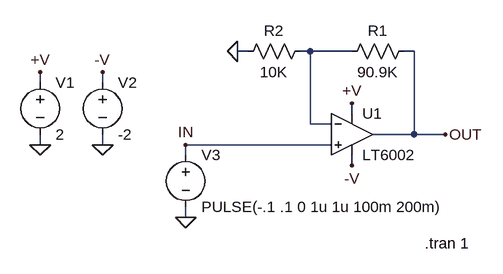
[diagram p0: schematic 6002.asc]
6002.asc, the LTspice schematic file:
Version 4
SHEET 1 880 756
WIRE 32 400 16 400
WIRE 128 400 112 400
WIRE 192 400 128 400
WIRE 288 400 272 400
WIRE -288 448 -288 432
WIRE -192 448 -192 432
WIRE 192 496 192 480
WIRE 128 512 128 400
WIRE 160 512 128 512
WIRE 288 528 288 400
WIRE 288 528 224 528
WIRE 336 528 288 528
WIRE -288 544 -288 528
WIRE -192 544 -192 528
WIRE 160 544 -64 544
WIRE -64 560 -64 544
WIRE 192 576 192 560
WIRE -64 656 -64 640
FLAG -288 544 0
FLAG -192 544 0
FLAG -64 656 0
FLAG -64 544 IN
FLAG 336 528 OUT
FLAG 192 480 +V
FLAG -288 432 +V
FLAG -192 432 -V
FLAG 192 576 -V
FLAG 16 400 0
SYMBOL voltage -288 432 R0
WINDOW 123 24 132 Left 2
WINDOW 39 0 0 Left 2
SYMATTR InstName V1
SYMATTR Value 2
SYMBOL voltage -192 432 R0
SYMATTR InstName V2
SYMATTR Value -2
SYMBOL voltage -64 544 R0
SYMATTR InstName V3
SYMATTR Value PULSE(-.1 .1 0 1u 1u 100m 200m)
SYMBOL res 288 384 R90
WINDOW 0 0 56 VBottom 2
WINDOW 3 32 56 VTop 2
SYMATTR InstName R1
SYMATTR Value 90.9K
SYMBOL res 128 384 R90
WINDOW 0 0 56 VBottom 2
WINDOW 3 32 56 VTop 2
SYMATTR InstName R2
SYMATTR Value 10K
SYMBOL LT6002 192 528 R0
SYMATTR InstName U1
TEXT 304 696 Left 2 !.tran 1

The netlist it stands for:
* 6002.asc
V1 +V 0 2
V2 -V 0 -2
V3 IN 0 PULSE(-.1 .1 0 1u 1u 100m 200m)
R1 OUT N001 90.9K
R2 N001 0 10K
* U1: LT6002 (symbol LT6002 not available, pins judged from their places): In+=IN In-=N001 V+=+V V-=-V OUT=OUT
.tran 1
.backanno
.end